# Altium schematic sheet PG02 Index and Revs.SchDoc: Index and Revisions
size B; Date: 2/10/2009; ApprovedBy: Touraj; DrawnBy: Juan A. Nadal; Engineer: Touraj; Organization: ActiveWave; Address1: 902 Clint Moore Rd., Suite 118; Address2: Boca Raton; Address3: FL, 33487; Address4: 561-999-9422; DocumentNumber: 2; Revision: 21; SheetNumber: 2; SheetTotal: 4; PageSetup: Record=PageOptions|CenterHorizontal=True|CenterVertical=True|PrintScale=0.68|XCorrection=1.00|YCorrection=1.00|PrintKind=0|BorderSize=5000000|LeftOffset=0|BottomOffset=0|Orientation=2|PaperLength=1000|PaperWidth=1000|Scale=100|PaperSource=7|PrintQuality=-4|MediaType=1|DitherType=10|PaperKind=Letter|PrintScaleMode=1; Project: Tag103
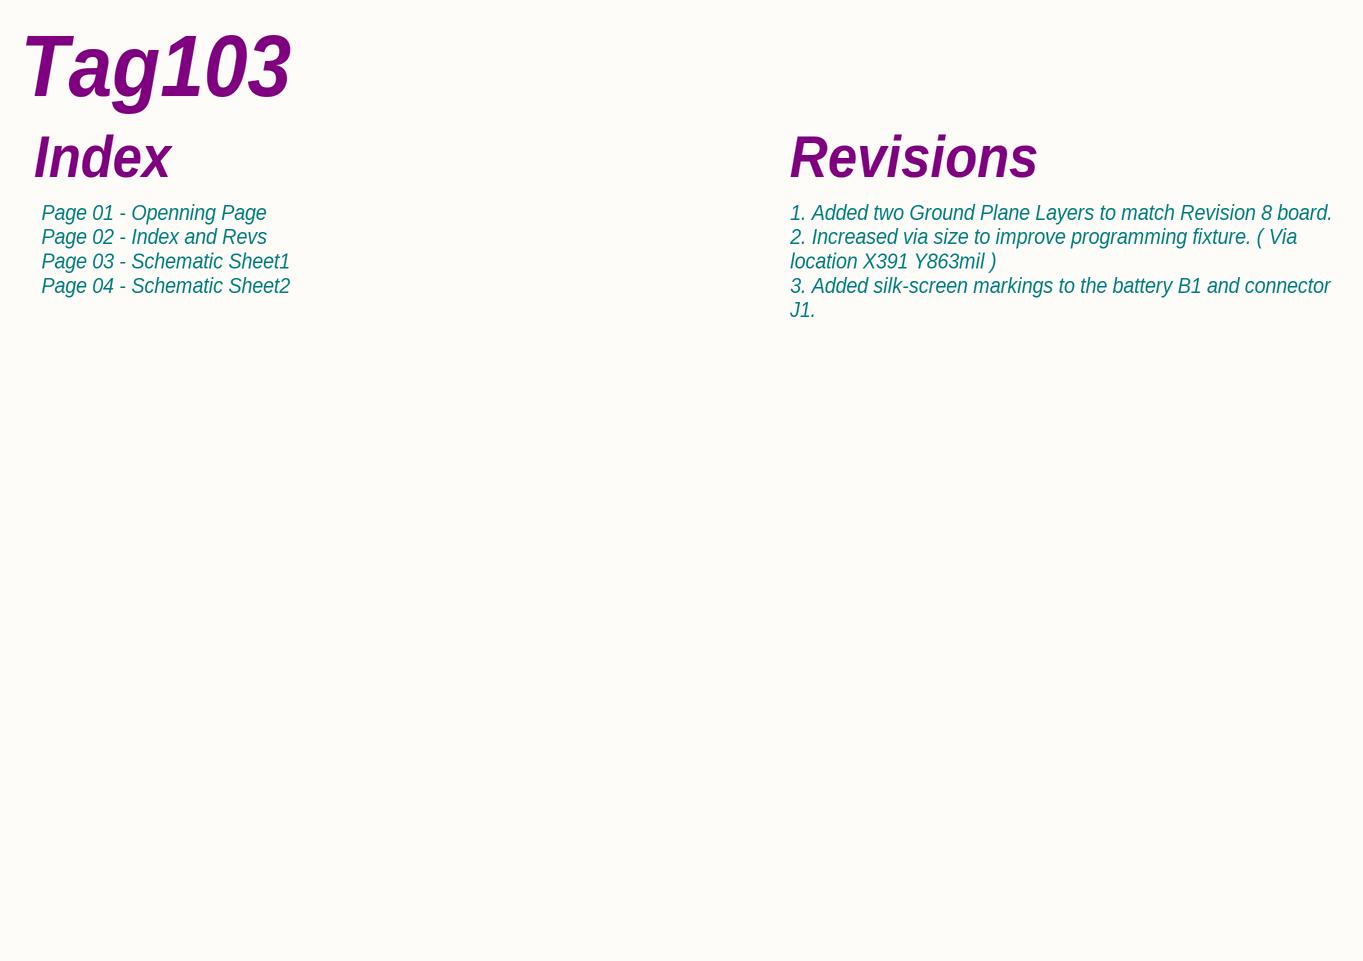
[diagram p0: PG02 Index and Revs.SchDoc]

## Notes on the sheet
- Tag103
- Index
- Revisions
- Page 01 - Openning Page
  Page 02 - Index and Revs
  Page 03 - Schematic Sheet1
  Page 04 - Schematic Sheet2
- 1. Added two Ground Plane Layers to match Revision 8 board.
  2. Increased via size to improve programming fixture. ( Via location X391 Y863mil )
  3. Added silk-screen markings to the battery B1 and connector J1.
- APPROVALS
- DATE
- Title:
- Drawn:
- Checked:
- Release:
- Date:
- Size:
- Sheet Name:
- B
- Number:
- Time:
- Revision:
- Sheet
- of
- File: